# EAGLE design multi-pcb-switches (EAGLE 9.6.2)
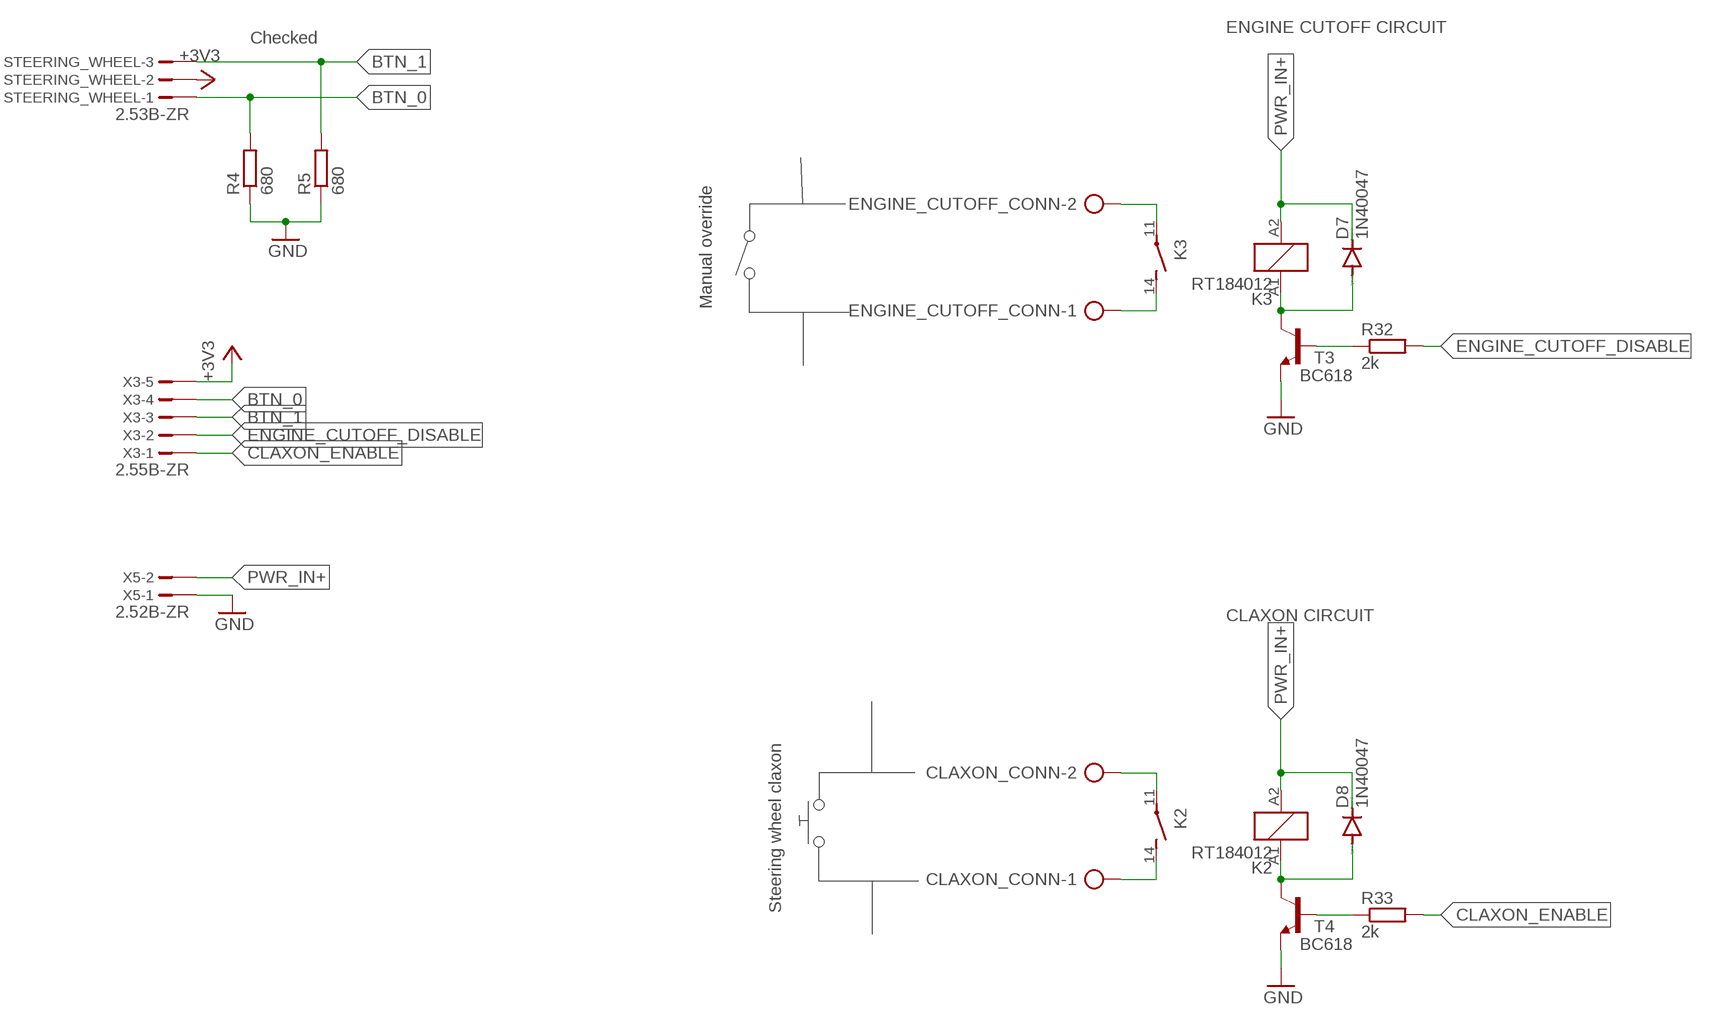
[diagram p0: schematic, sheet 1]

## Parts
CLAXON_CONN  AK300/2  [AK300/2]
D7  1N40047  [DO41-7.6]
D8  1N40047  [DO41-7.6]
ENGINE_CUTOFF_CONN  AK300/2  [AK300/2]
K2  RT184012  [RT-N/O12A3.5]
K3  RT184012  [RT-N/O12A3.5]
R4  680  R-EU_0207/7  [0207/7]
R5  680  R-EU_0207/7  [0207/7]
R32  2k  R-EU_0207/7  [0207/7]
R33  2k  R-EU_0207/7  [0207/7]
STEERING_WHEEL  2.53B-ZR  [B3B-ZR2.5]
T3  BC618  [TO92-EBC]
T4  BC618  [TO92-EBC]
X3  2.55B-ZR  [B5B-ZR2.5]
X5  2.52B-ZR  [B2B-ZR2.5]

## Nets
+3V3: STEERING_WHEEL.2 X3.5
BTN_0: R4.2 STEERING_WHEEL.1 X3.4
BTN_1: R5.2 STEERING_WHEEL.3 X3.3
CLAXON_ENABLE: R33.2 X3.1
ENGINE_CUTOFF_DISABLE: R32.2 X3.2
GND: R4.1 R5.1 T3.E T4.E X5.1
N$19: ENGINE_CUTOFF_CONN.2 K3.11(2:P)
N$20: ENGINE_CUTOFF_CONN.1 K3.14(2:S)
N$22: D7.A K3.A1 T3.C
N$23: D8.A K2.A1 T4.C
N$25: R33.1 T4.B
N$26: R32.1 T3.B
N$27: CLAXON_CONN.2 K2.11(2:P)
N$28: CLAXON_CONN.1 K2.14(2:S)
PWR_IN+: D7.C D8.C K2.A2 K3.A2 X5.2

## Notes on the sheet
- ENGINE CUTOFF CIRCUIT
- Checked
- Manual override
- CLAXON CIRCUIT
- Steering wheel claxon

## Library data of the parts
CLAXON_CONN ENGINE_CUTOFF_CONN = con-ptr500-custom:AK300/2: CONNECTOR; OC_FARNELL: unknown; OC_NEWARK: unknown
D7 D8 = diode-custom:1N4004: DIODE general purpose rectifier, 1 A
K2 K3 = relay:RT?*: Power PCB Relay SCHRACK 1 pole 12 / 16 A, DC- or AC-coil Source: http://www.schrack.com/.. 5819.pdf; MF: TYCO ELECTRONICS; MPN: RT184012; OC_FARNELL: unknown; OC_NEWARK: 08H3731
R4 R5 R32 R33 = rcl:R-EU_: RESISTOR, European symbol; SPICEPREFIX: R
STEERING_WHEEL = con-jst-custom:?3B-ZR: ZH CONNECTOR 1.5 mm, 4 pin 1 row Source: http://www.jst.com .. eZH.pdf
T3 T4 = transistor-npn:BC618*: NPN Transistor
X3 = con-jst-custom:?5B-ZR: ZH CONNECTOR 1.5 mm, 4 pin 1 row Source: http://www.jst.com .. eZH.pdf
X5 = con-jst-custom:?2B-ZR: ZH CONNECTOR 1.5 mm, 4 pin 1 row Source: http://www.jst.com .. eZH.pdf

## Board
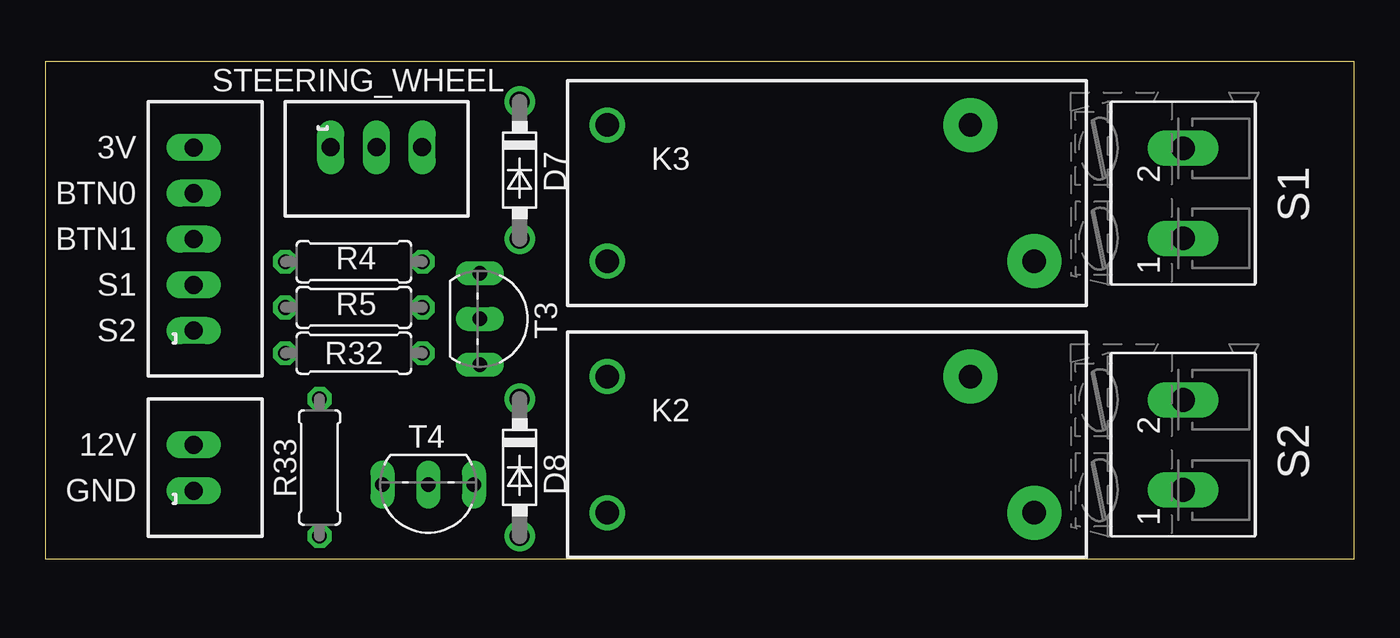
[diagram p1: board, top side]
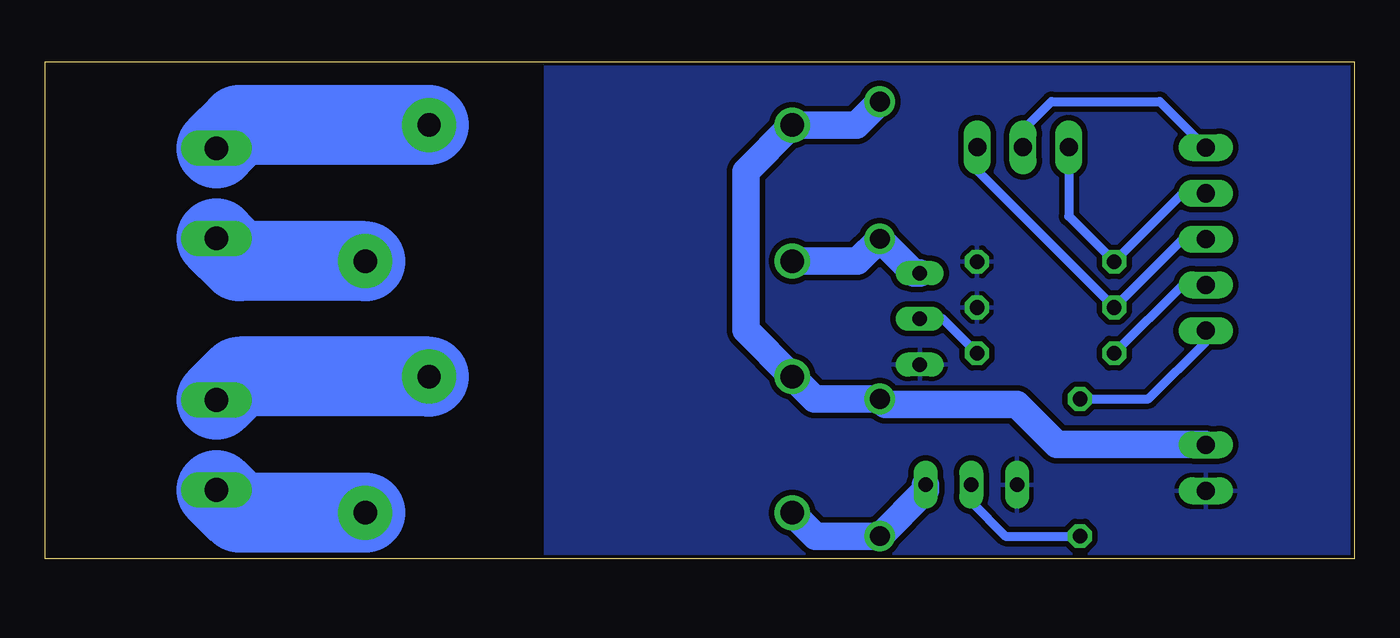
[diagram p2: board, bottom side, seen from below]

Size 72.69 x 27.61 mm. Coordinates in mm from the lower left corner, seen from the top.
Outline: 0,0 72.69,0 72.69,27.61 0,27.61 0,0
Copper layers (1*16): Top 0.035mm / dielectric 1.5mm / Bottom 0.035mm
Design rules "home-made-pcb": minimum track width 8mil, minimum drill 0.3mm, track to track 12mil, track to pad 8mil, pad to pad 10mil, via to via 10mil, smd to smd 6mil, copper to edge 8mil, drill to drill 10mil, minimum pad ring 10mil, minimum via ring 20mil, stop-mask expansion 4mil, vias tented up to drill 0mil, thermal gap 10mil

### Footprints (pad centres in the part's own frame; a part is rotated, then mirrored left to right if it is on the bottom)
AK300/2 = drill 1.321 long: 1 -2.515,0; 2 2.489,0
DO41-7.6 = drill 1.1 pad 1.7: A 3.81,0; C -3.81,0
RT-N/O12A3.5 = drill 1.3 pad 3: 11 7.56,3.78; 14 11.1,-3.78 | drill 1.3: A1 -12.6,-3.78; A2 -12.6,3.78
0207/7 = drill 0.813 octagon: 1 -3.81,0; 2 3.81,0
B3B-ZR2.5 = drill 1 pad 1.422 long: 1 -2.555,0; 2 -0.013,0; 3 2.527,0
TO92-EBC = drill 0.813 long: B 0,-1.27; C -2.54,-1.27; E 2.54,-1.27
B5B-ZR2.5 = drill 1 pad 1.422 long: 1 -5.095,0; 2 -2.553,0; 3 -0.013,0; 4 2.527,0; 5 5.067,0
B2B-ZR2.5 = drill 1 pad 1.422 long: 1 -1.285,0; 2 1.257,0

### Placement (x,y rotation side)
CLAXON_CONN  63.18,6.35 90 top
D7  26.35,21.59 270 top
D8  26.35,5.08 270 top
ENGINE_CUTOFF_CONN  63.18,20.32 90 top
K2  43.81,6.35 0 top
K3  43.81,20.32 0 top
R4  17.14,16.51 180 top
R5  17.14,13.97 180 top
R32  17.14,11.43 180 top
R33  15.24,5.08 90 top
STEERING_WHEEL  18.41,22.86 0 top
T3  25.4,13.34 270 top
T4  21.27,2.86 180 top
X3  8.26,17.78 90 top
X5  8.26,5.08 90 top

### Tracks (layer width: path | path; a pad name or v marks a point on that pad's centre or on a via)
+3V3
  Bottom 0.508: STEERING_WHEEL.2 18.4,23.81 16.81,25.4 10.81,25.4 X3.5
BTN_0
  Bottom 0.508: STEERING_WHEEL.1 15.86,19.04 R4.2 9.54,20.31 X3.4
BTN_1
  Bottom 0.508: X3.3 9.54,17.77 R5.2 20.94,21.58 STEERING_WHEEL.3
CLAXON_ENABLE
  Bottom 0.508: R33.2 11.43,8.89 8.26,12.06 X3.1
ENGINE_CUTOFF_DISABLE
  Bottom 0.508: R32.2 9.53,15.23 X3.2
GND
  pour Bottom: -1.27,28.26 -1.27,-0.95 75.88,-0.95 75.88,28.26
  cutout Bottom (isolate 0.254): 45.09,28.26 45.09,-0.95 73.98,-0.95 73.98,28.26
N$19
  Bottom 4.445: K3.11 61.89,24.1 ENGINE_CUTOFF_CONN.2
N$20
  Bottom 4.445: K3.14 61.92,16.54 ENGINE_CUTOFF_CONN.1
N$22
  Bottom 1.524: K3.A1 27.59,16.54 D7.A 24.45,15.88 T3.C
N$23
  Bottom 1.524: K2.A1 29.91,1.27 D8.A 23.81,3.81 T4.C
N$25
  Bottom 0.508: T4.B 21.27,3.17 19.37,1.27 R33.1
N$26
  Bottom 0.508: T3.B 22.86,13.34 R32.1
N$27
  Bottom 4.445: K2.11 61.89,10.13 CLAXON_CONN.2
N$28
  Bottom 4.445: K2.14 61.92,2.57 CLAXON_CONN.1
PWR_IN+
  Bottom 1.524: X5.2 16.51,6.35 18.73,8.57 26.04,8.57 D8.C 29.98,8.89 K2.A2 33.79,12.71 33.79,21.52 K3.A2 27.65,24.1 D7.C

### Text on the board
tPlace: 3V | BTN0 | S1 | BTN1 | S1 | S2 | 12V | GND | S2